# Altium schematic sheet Modulo-1B-TY.SchDoc
size B; Revision: PVT
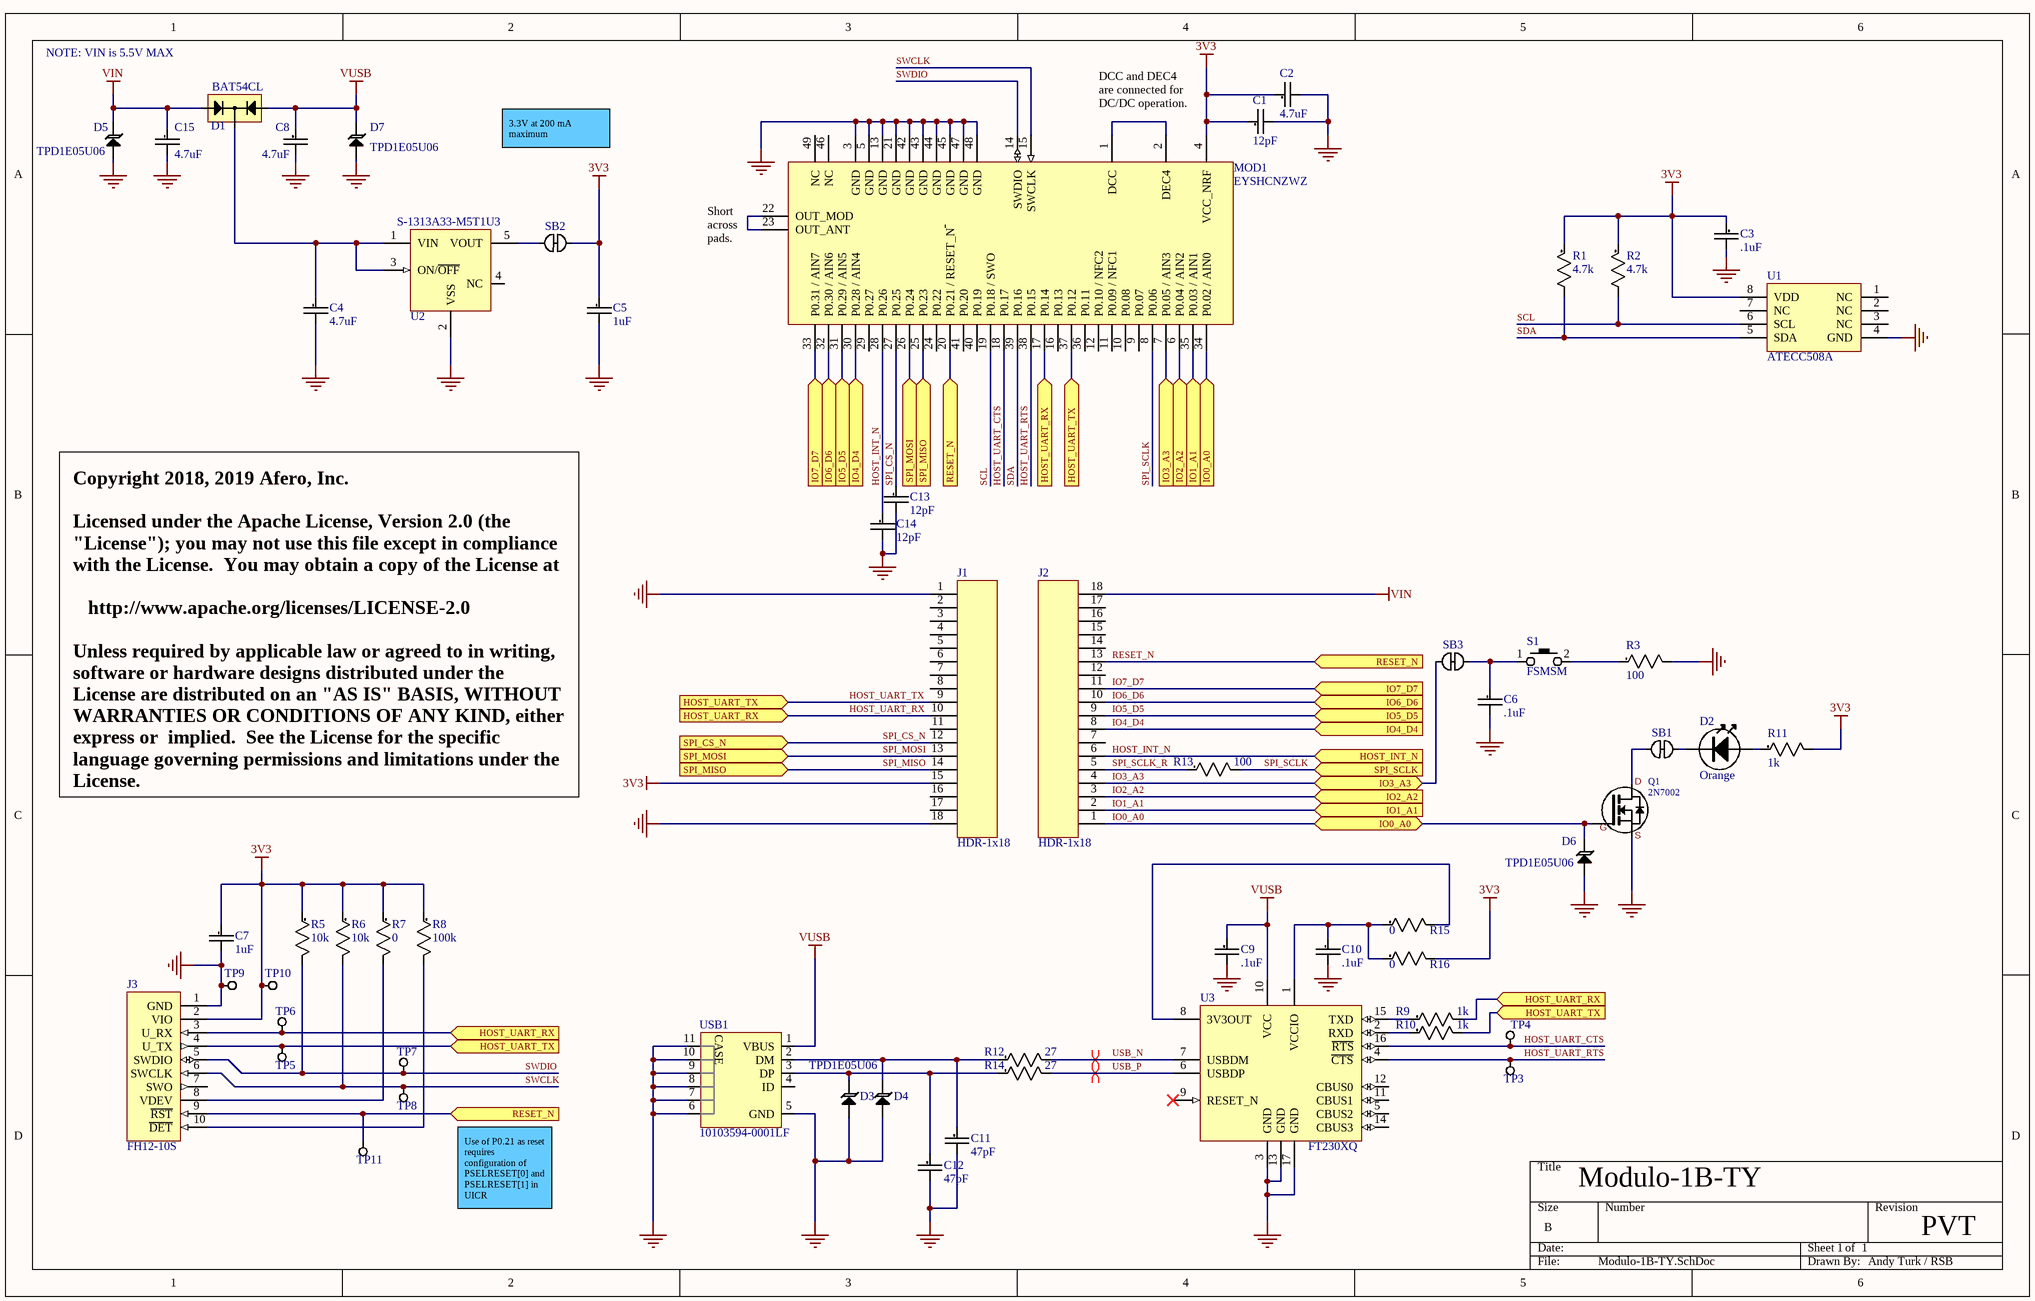
[diagram p0: Modulo-1B-TY.SchDoc]

## Parts
C1  12pF  [0402C-GENERIC]
C2  4.7uF  [0603C-GENERIC]
C3  .1uF  [0402C-GENERIC]
C4  4.7uF  [0603C-GENERIC]
C5  1uF  [0402C-GENERIC]
C6  .1uF  [0402C-GENERIC]
C7  1uF  [0402C-GENERIC]
C8  4.7uF  [0603C-GENERIC]
C9  .1uF  [0402C-GENERIC]
C10  .1uF  [0402C-GENERIC]
C11  47pF  [0402C-GENERIC]
C12  47pF  [0402C-GENERIC]
C13  12pF  [0402C-GENERIC]
C14  12pF  [0402C-GENERIC]
C15  4.7uF  [0603C-GENERIC]
D1  BAT54CL  [SOT23]
D2  Orange  [0603LED]
D3  TPD1E05U06  [SON70P100X45-2N]
D4  TPD1E05U06  [SON70P100X45-2N]  (value not drawn)
D5  TPD1E05U06  [SON70P100X45-2N]
D6  TPD1E05U06  [SON70P100X45-2N]
D7  TPD1E05U06  [SON70P100X45-2N]
J1  HDR-1x18  [HDR-1X18]
J2  HDR-1x18  [HDR-1X18]
J3  FH12-10S
MOD1  EYSHCNZWZ  [EYSHCNZWZ]
Q1  2N7002  [SOT23]
R1  4.7k  [0402R-GENERIC]
R2  4.7k  [0402R-GENERIC]
R3  100  [0402R-GENERIC]
R5  10k  [0402R-GENERIC]
R6  10k  [0402R-GENERIC]
R7  0  [0603R-generic]
R8  100k  [0402R-GENERIC]
R9  1k  [0402R-GENERIC]
R10  1k  [0402R-GENERIC]
R11  1k  [0402R-GENERIC]
R12  27  [0402R-GENERIC]
R13  100  [0402R-GENERIC]
R14  27  [0402R-GENERIC]
R15  0  [0402R-GENERIC]
R16  0  [0402R-GENERIC]
S1  FSMSM  [FSMSM]
SB1  Solderbridge  [SBNC]  (value not drawn)  (net tie, no BOM)
SB2  Solderbridge  [SBNC]  (value not drawn)  (net tie, no BOM)
SB3  Solderbridge  [SBNC]  (value not drawn)  (net tie, no BOM)
TP3  TP1MM  [TP1MM]  (value not drawn)  (no BOM)
TP4  TP1MM  [TP1MM]  (value not drawn)  (no BOM)
TP5  TP1MM  [TP1MM]  (value not drawn)  (no BOM)
TP6  TP1MM  [TP1MM]  (value not drawn)  (no BOM)
TP7  TP1MM  [TP1MM]  (value not drawn)  (no BOM)
TP8  TP1MM  [TP1MM]  (value not drawn)  (no BOM)
TP9  TP1MM  [TP1MM]  (value not drawn)  (no BOM)
TP10  TP1MM  [TP1MM]  (value not drawn)  (no BOM)
TP11  TP1MM  [TP1MM]  (value not drawn)  (no BOM)
U1  ATECC508A  [SON50P300X60-8N]
U2  S-1313A33-M5T1U3  [SOT95P275X130-5N]
U3  FT230XQ  [VQFN65P400X400X90-16N]
USB1  10103594-0001LF  [10103594-0001LF]

## Ports
HOST_INT_N, HOST_UART_RX, HOST_UART_TX, IO0_A0, IO1_A1, IO2_A2, IO3_A3, IO4_D4, IO5_D5, IO6_D6, IO7_D7, RESET_N, SPI_CS_N, SPI_MISO, SPI_MOSI, SPI_SCLK (in)

## Nets
3V3: C1.1 C2.1 C3.1 C5.1 C7.1 J1.15 J3.2(VIO) MOD1.4(VCC_NRF) R1.1 R2.1 R5.1 R6.1 R7.1 R8.1 R11.2 R16.2 SB2.2 TP10.1 U1.8(VDD)
GND: C1.2 C2.2 C3.2 C4.2 C5.2 C6.2 C7.2 C8.2 C9.2 C10.2 C11.2 C12.2 C13.2 C14.2 C15.2 D3.2(GND) D4.2(GND) D5.2(GND) D6.2(GND) D7.2(GND) J1.1 J1.18 J3.1(GND) MOD1.3(GND) MOD1.5(GND) MOD1.13(GND) MOD1.21(GND) MOD1.42(GND) MOD1.43(GND) MOD1.44(GND) MOD1.45(GND) MOD1.47(GND) MOD1.48(GND) Q1.2(S) R3.2 TP9.1 U1.4(GND) U2.2(VSS) U3.3(GND) U3.13(GND) U3.17(GND) USB1.5(GND) USB1.6(CASE) USB1.7(CASE) USB1.8(CASE) USB1.9(CASE) USB1.10(CASE) USB1.11(CASE)
VIN: C15.1 D1.1 D5.1(I/O) J2.18
VUSB: C8.1 C9.1 D1.2 D7.1(I/O) U3.10(VCC) USB1.1(VBUS)
HOST_INT_N: C14.1 J2.6 MOD1.28(P0.26) ; port HOST_INT_N
HOST_UART_CTS: MOD1.18(P0.17) TP4.1 U3.16(~{RTS})
HOST_UART_RTS: MOD1.38(P0.15) TP3.1 U3.4(~{CTS})
HOST_UART_RX: J1.10 J3.3(U_RX) MOD1.17(P0.14) R9.2 TP6.1 ; port HOST_UART_RX
HOST_UART_TX: J1.9 J3.4(U_TX) MOD1.37(P0.12) R10.2 TP5.1 ; port HOST_UART_TX
IO0_A0: D6.1(I/O) J2.1 MOD1.34(P0.02_/_AIN0) Q1.1(G) ; port IO0_A0
IO1_A1: J2.2 MOD1.35(P0.03_/_AIN1) ; port IO1_A1
IO2_A2: J2.3 MOD1.6(P0.04_/_AIN2) ; port IO2_A2
IO3_A3: J2.4 MOD1.7(P0.05_/_AIN3) SB3.1 ; port IO3_A3
IO4_D4: J2.8 MOD1.30(P0.28_/_AIN4) ; port IO4_D4
IO5_D5: J2.9 MOD1.31(P0.29_/_AIN5) ; port IO5_D5
IO6_D6: J2.10 MOD1.32(P0.30_/_AIN6) ; port IO6_D6
IO7_D7: J2.11 MOD1.33(P0.31_/_AIN7) ; port IO7_D7
RESET_N: J2.13 J3.9(~{RST}) MOD1.20(P0.21_/_RESET_N~{_}) TP11.1 ; port RESET_N
SCL: MOD1.19(P0.18_/_SWO) R2.2 U1.6(SCL)
SDA: MOD1.39(P0.16) R1.2 U1.5(SDA)
SPI_CS_N: C13.1 J1.12 MOD1.27(P0.25) ; port SPI_CS_N
SPI_MISO: J1.14 MOD1.25(P0.23) ; port SPI_MISO
SPI_MOSI: J1.13 MOD1.26(P0.24) ; port SPI_MOSI
SPI_SCLK: MOD1.8(P0.06) R13.2 ; port SPI_SCLK
SPI_SCLK_R: J2.5 R13.1
SWCLK: J3.6(SWCLK) MOD1.15(SWCLK) R6.2 TP8.1
SWDIO: J3.5(SWDIO) MOD1.14(SWDIO) R5.2 TP7.1
USB_N: R12.2 U3.7(USBDM)
USB_P: R14.2 U3.6(USBDP)
NetC4_1: C4.1 D1.3 U2.1(VIN) U2.3(ON/~{OFF})
NetC6_1: C6.1 S1.1 SB3.2
NetC10_1: C10.1 R15.1 R16.1 U3.1(VCCIO)
NetC11_1: C11.1 D4.1(I/O) R12.1 USB1.2(DM)
NetC12_1: C12.1 D3.1(I/O) R14.1 USB1.3(DP)
NetD2_A: D2.A R11.1
NetD2_K: D2.K SB1.2
NetJ3_8: J3.8(VDEV) R7.2
NetJ3_10: J3.10(~{DET}) R8.2
NetMOD1_1: MOD1.1(DCC) MOD1.2(DEC4)
NetMOD1_22: MOD1.22(OUT_MOD) MOD1.23(OUT_ANT)
NetQ1_3: Q1.3(D) SB1.1
NetR3_1: R3.1 S1.2
NetR9_1: R9.1 U3.15(TXD)
NetR10_1: R10.1 U3.2(RXD)
NetR15_2: R15.2 U3.8(3V3OUT)
NetSB2_1: SB2.1 U2.5(VOUT)

Not connected (* = marked no-connect by the designer): J1 2 3 4 5 6 7 8 11 16 17; J2 7 12 14 15 16 17; J3 7(SWO); MOD1 9(P0.07) 10(P0.08) 11(P0.09_/_NFC1) 12(P0.10_/_NFC2) 16(P0.13) 24(P0.22) 29(P0.27) 36(P0.11) 40(P0.19) 41(P0.20) 46(NC) 49(NC); U1 1(NC) 2(NC) 3(NC) 7(NC); U2 4(NC); U3 5(CBUS2) 9(RESET_N)* 11(CBUS1) 12(CBUS0) 14(CBUS3); USB1 4(ID)

## Layout directives
differential pair: USB_N, USB_P

## Notes on the sheet
- NOTE: VIN is 5.5V MAX
- 3.3V at 200 mA maximum
- (near MOD1) DCC and DEC4 are connected for DC/DC operation.
- (near MOD1) Short across pads.
- Copyright 2018, 2019 Afero, Inc.
  Licensed under the Apache License, Version 2.0 (the "License"); you may not use this file except in compliance with the License.  You may obtain a copy of the License at
  http://www.apache.org/licenses/LICENSE-2.0
  Unless required by applicable law or agreed to in writing, software or hardware designs distributed under the License are distributed on an "AS IS" BASIS, WITHOUT WARRANTIES OR CONDITIONS OF ANY KIND, either express or  implied.  See the License for the specific language governing permissions and limitations under the License.
- Modulo-1B-TY
- Use of P0.21 as reset requires configuration of PSELRESET[0] and PSELRESET[1] in UICR
- 1
- Andy Turk / RSB

## Library data of the parts
C1 C13 C14 = 0402C-12p: Capacitor, C0G; Manufacturer: Murata; Manufacturer Part Number: GJM1555C1H120FB01D; Tolerance: 1%; Voltage Rating: 50V; item_number: E-CAP-00106-00; Supplier 1: Digi-Key; Supplier Part Number 1: 490-11190-1-ND; Mount: Surface Mount; Case/Package: 0402; Case Code (Metric): 1005; Case Code (Imperial): 0402; Min Operating Temperature: -55°C; Max Operating Temperature: 125°C; Capacitance: 12pF; Voltage Rating (DC): 50V; Packaging: Tape and Reel; Package Quantity: 10000; Dielectric: C0G; Termination: SMD/SMT; Length: 1mm; Height: 0.5mm; Width: 0.02inch; Thickness: 0.022inch; Depth: 0.5mm; Radiation Hardening: No; REACH SVHC: No SVHC; Lead Free: Lead Free
C2 C4 C8 C15 = 0603C-4u7: Capacitor; Manufacturer: Murata; Manufacturer Part Number: GRM188R61C475KAAJD; Value: 4u7; Material: Ceramic; Tolerance: 10%; Dielectric: X5R; Voltage Rating: 16V; item_number: E-CAP-00066-00; Supplier 1: Mouser; Stock 1: 241267; Pricing 1: 1=0.27, 10=0.184, 50=0.184, 100=0.105, 1000=0.065, 10000=0.054 (USD); Mount: Surface Mount; Case/Package: 0603; Weight: 0.000222oz; Case Code (Metric): 1608; Case Code (Imperial): 0603; Min Operating Temperature: -55°C; Max Operating Temperature: 85°C; Capacitance: 4.7uF; Packaging: Tape and Reel; Termination: SMD/SMT; Voltage Rating (DC): 16V; Package Quantity: 4000; Length: 1.6mm; Height: 0.8mm; Width: 0.8mm; Thickness: 0.037inch; Depth: 0.8mm; REACH SVHC: No SVHC; Lead Free: Lead Free; ComponentLink1URL: https://datasheet.ciiva.com/14813/595grm188r61c475kaaj23-14813668.pdf; ComponentLink1Description: https://datasheet.ciiva.com/14813/595grm188r61c475kaaj23-14813668.pdf; Supplier Part Number 1: 81-GRM188R61C475KAJD
C3 C6 C9 C10 = 0402C-100n: Capacitor, MLCC; Manufacturer: Murata; Manufacturer Part Number: GRM155R61H104KE19D; Tolerance: 10%; Voltage Rating: 50V; Dielectric: X5R; item_number: E-CAP-00004-00; Supplier 1: Mouser; Stock 1: 727844; Pricing 1: 1=0.1, 10=0.068, 50=0.068, 100=0.03, 1000=0.017, 10000=0.011 (USD); Mount: Surface Mount; Case/Package: 0402; Case Code (Metric): 1005; Case Code (Imperial): 0402; Min Operating Temperature: -55°C; Max Operating Temperature: 85°C; Packaging: Tape and Reel; Capacitance: .1uF; Voltage: 50V; Voltage Rating (DC): 50V; Length: 1mm; Height: 0.5mm; Width: 0.02inch; Thickness: 0.022inch; Depth: 0.5mm; REACH SVHC: No SVHC; Lead Free: Lead Free; ComponentLink1URL: https://datasheet.ciiva.com/22698/1666664-22698413.pdf; ComponentLink1Description: https://datasheet.ciiva.com/22698/1666664-22698413.pdf; ComponentLink2URL: https://datasheet.ciiva.com/7719/1666664-7719007.pdf; ComponentLink2Description: https://datasheet.ciiva.com/7719/1666664-7719007.pdf; Supplier Part Number 1: 81-GRM155R61H104KE9D
C5 C7 = 0402C-1u: Capacitor, MLCC; Manufacturer: Murata Electronics; Manufacturer Part Number: GRM155R60J105ME19J; Tolerance: 20 %; Type: Chip Monolithic Ceramic Capacitor; Voltage Rating DC: 6.3 VDC; Capacitance - nF: 1000 nF; Dielectric: X5R; Value: 1u; item_number: E-CAP-00020-00; Supplier 1: Mouser; RoHS: RoHS Compliant; Category: Multilayer Ceramic Capacitors MLCC - SMD/SMT; Stock 1: 17644; Pricing 1: 1=0.100, 10=0.080, 100=0.040, 500=0.030, 1000=0.020, 50000=0.020 (USD); Capacitance: 1uF; Height: 0.5 mm; Length: 1 mm; Package / Case: 0402 (1005 metric); Packaging: Cut Tape; Product: General Type MLCCs; Series: GRM; Termination Style: SMD/SMT; Width: 0.5 mm; Brand: Murata Electronics; Case Code - in: 0402; Case Code - mm: 1005; Maximum Operating Temperature: + 85 C; Minimum Operating Temperature: - 55 C; Standard Pack Qty: 50000; RoHS - Mouser: Y; Minimum Order Quantity: 1; Reeling: True; ComponentLink1URL: http://www.mouser.com/ds/2/281/c02e-2905.pdf; ComponentLink1Description: http://www.mouser.com/ds/2/281/c02e-2905.pdf; Supplier Part Number 1: 81-GRM155R60J105ME9J
C11 C12 = 0402C-47p: Capacitor, C0G; Manufacturer: Murata; Manufacturer Part Number: GRM1555C1H470JZ01D; Dielectric Material: Ceramic; Tolerance: 5%; Voltage Rating: 50V; Temperature Coefficient: 30ppm/°C; Insulation Resistance: 10GR; item_number: E-CAP-00019-00; Supplier 1: Digi-Key; Supplier Part Number 1: 490-1287-2-ND; Stock 1: 0; Mount: Surface Mount; Case/Package: 0402; Number of Pins: 2; Case Code (Metric): 1005; Case Code (Imperial): 0402; Min Operating Temperature: -55°C; Max Operating Temperature: 125°C; Packaging: Tape and Reel; Capacitance: 47pF; Dielectric: C0G; Voltage Rating (DC): 50V; Package Quantity: 1; Termination: SMD/SMT; Voltage: 50V; Length: 1mm; Height: 0.5mm; Width: 0.5mm; Depth: 0.5mm; Thickness: 0.022inch; Radiation Hardening: No; REACH SVHC: No SVHC; Lead Free: Lead Free; ComponentLink1URL: https://datasheet.ciiva.com/129/product-129747.pdf; ComponentLink1Description: https://datasheet.ciiva.com/129/product-129747.pdf; ComponentLink2URL: https://datasheet.ciiva.com/11787/0900766b807a1cab-11787251.pdf; ComponentLink2Description: https://datasheet.ciiva.com/11787/0900766b807a1cab-11787251.pdf; ComponentLink3URL: https://datasheet.ciiva.com/129/partnumbering-e-01-129748.pdf; ComponentLink3Description: https://datasheet.ciiva.com/129/partnumbering-e-01-129748.pdf; ComponentLink4URL: https://datasheet.ciiva.com/129/partnumbering-e-01-129749.pdf; ComponentLink4Description: https://datasheet.ciiva.com/129/partnumbering-e-01-129749.pdf; ComponentLink5URL: https://datasheet.ciiva.com/16396/l0005e-16396809.pdf; ComponentLink5Description: https://datasheet.ciiva.com/16396/l0005e-16396809.pdf; ComponentLink6URL: https://datasheet.ciiva.com/18100/getdatasheetpartid-32342-18100875.pdf; ComponentLink6Description: https://datasheet.ciiva.com/18100/getdatasheetpartid-32342-18100875.pdf
D1 = BAT54CL: Dual Common Cathode  Schottky  Diodes; Manufacturer: ON Semiconductor; Manufacturer Part Number: BAT54CLT1G; Forward Current: 200mA; Recovery Time: 5ns; Max Reverse Leakage Current: 2uA; Max Forward Surge Current (Ifsm): 600mA; Max Reverse Voltage (DC): 30V; Max Power Dissipation: 225mW; Capacitance: 10pF; Forward Voltage: 800mV; item_number: E-DIO-00010-00; Supplier 1: Digi-Key; Supplier Part Number 1: BAT54CLT1GOSCT-ND; Stock 1: 151531; Pricing 1: 1=0.15, 10=0.133, 100=0.0727, 500=0.0447, 1000=0.0305 (USD); Case/Package: SOT-23-3; Number of Pins: 3; Contact Plating: Tin,Matte; Min Operating Temperature: -55°C; Max Operating Temperature: 125°C; Element Configuration: Common Cathode; Packaging: Tape and Reel; Package Quantity: 3000; Average Rectified Current: 200mA; Reverse Recovery Time: 5ns; Max Surge Current: 600mA; Peak Non-Repetitive Surge Current: 600mA; Max Repetitive Reverse Voltage (Vrrm): 30V; Current Rating: 200mA; Voltage Rating (DC): 30V; Peak Reverse Current: 2uA; Power Dissipation: 225mW; Length: 3.04mm; Height: 1.01mm; Width: 1.4mm; Radiation Hardening: No; Lead Free: Lead Free; Halogen Free: Halogen Free; REACH SVHC: No SVHC; ComponentLink1URL: https://datasheet.ciiva.com/1240/bat54clt1-d-1240707.pdf; ComponentLink1Description: https://datasheet.ciiva.com/1240/bat54clt1-d-1240707.pdf; ComponentLink2URL: https://datasheet.ciiva.com/22659/1918740-22659014.pdf; ComponentLink2Description: https://datasheet.ciiva.com/22659/1918740-22659014.pdf; ComponentLink3URL: https://datasheet.ciiva.com/34301/885769-34301654.pdf; ComponentLink3Description: https://datasheet.ciiva.com/34301/885769-34301654.pdf; ComponentLink4URL: https://datasheet.ciiva.com/1180/bat54clt1-d-1180247.pdf; ComponentLink4Description: https://datasheet.ciiva.com/1180/bat54clt1-d-1180247.pdf; ComponentLink5URL: https://datasheet.ciiva.com/1180/bat54clt1-d-1180248.pdf; ComponentLink5Description: https://datasheet.ciiva.com/1180/bat54clt1-d-1180248.pdf; ComponentLink6URL: https://datasheet.ciiva.com/30479/0900766b8121b932-30479128.pdf; ComponentLink6Description: https://datasheet.ciiva.com/30479/0900766b8121b932-30479128.pdf; ComponentLink7URL: https://datasheet.ciiva.com/15144/getdatasheetpartid-98336-15144809.pdf; ComponentLink7Description: https://datasheet.ciiva.com/15144/getdatasheetpartid-98336-15144809.pdf; ComponentLink8URL: https://datasheet.ciiva.com/16205/bat54clt1-d-16205033.pdf; ComponentLink8Description: https://datasheet.ciiva.com/16205/bat54clt1-d-16205033.pdf; ComponentLink9URL: https://datasheet.ciiva.com/905/bat54clt1-d-905835.pdf; ComponentLink9Description: https://datasheet.ciiva.com/905/bat54clt1-d-905835.pdf; ComponentLink10URL: https://datasheet.ciiva.com/28655/bat54clt1-d-28655787.pdf; ComponentLink10Description: https://datasheet.ciiva.com/28655/bat54clt1-d-28655787.pdf; ComponentLink11URL: https://datasheet.ciiva.com/8299/bat54clt1-d-8299644.pdf; ComponentLink11Description: https://datasheet.ciiva.com/8299/bat54clt1-d-8299644.pdf; ComponentLink12URL: https://datasheet.ciiva.com/8294/bat54clt1-d-8294495.pdf; ComponentLink12Description: https://datasheet.ciiva.com/8294/bat54clt1-d-8294495.pdf
D2 = LED_0603: Manufacturer: Vishay Lite-On; Manufacturer Part Number: LTST-C190KAKT; Colour: Red,Orange; Lens Colour: Colorless; Forward Voltage: 2V; Test Current: 20mA; Forward Current: 30mA; Wavelength: 621nm; Luminous Intensity: 54mcd; Lens Style: Flat,Diffused,Colorless,Rectangular; Viewing Angle: 130°; Dominant Wavelength: 615nm; Lens Transparency: Clear; Number of Elements: 1; Power Dissipation: 75mW; Reverse Voltage: 5V; item_number: E-LED-00009-00; Supplier 1: Digi-Key; Supplier Part Number 1: 160-1433-1-ND; Stock 1: 60967; Pricing 1: 1=0.41, 10=0.296, 25=0.2268, 100=0.148, 250=0.1085, 500=0.0921, 1000=0.0757 (USD); Mount: Surface Mount; Case/Package: 0603; Number of Pins: 2; Case Code (Metric): 1608; Case Code (Imperial): 0603; Min Operating Temperature: -55°C; Max Operating Temperature: 85°C; Packaging: Tape and Reel; Package Quantity: 1; Illumination Colour: Orange; Number of LEDs: 1; Orientation: Top View; Length: 1.6mm; Height: 0.8mm; Width: 0.8mm; Depth: 1.6mm; Radiation Hardening: No; Lead Free: Lead Free; ComponentLink1URL: https://datasheet.ciiva.com/24120/ltst-c190kakt-267511-24120611.pdf; ComponentLink1Description: https://datasheet.ciiva.com/24120/ltst-c190kakt-267511-24120611.pdf; ComponentLink2URL: https://datasheet.ciiva.com/26937/getdatasheetpartid-257177-26937956.pdf; ComponentLink2Description: https://datasheet.ciiva.com/26937/getdatasheetpartid-257177-26937956.pdf; ComponentLink3URL: https://datasheet.ciiva.com/2110/ltst-c150-170-190kxkt-2110261.pdf; ComponentLink3Description: https://datasheet.ciiva.com/2110/ltst-c150-170-190kxkt-2110261.pdf; ComponentLink4URL: https://datasheet.ciiva.com/2110/ltst-c150-170-190kxkt-2110262.pdf; ComponentLink4Description: https://datasheet.ciiva.com/2110/ltst-c150-170-190kxkt-2110262.pdf; ComponentLink5URL: https://datasheet.ciiva.com/2110/ltst-c150-170-190kxkt-2110263.pdf; ComponentLink5Description: https://datasheet.ciiva.com/2110/ltst-c150-170-190kxkt-2110263.pdf
D3-D7 = TPD1E05U06: TVS Diode; Manufacturer: Texas Instruments; Manufacturer Part Number: TPD1E05U06DPYR; Number of Channels: 1; Interface: LVDS,USB,Ethernet,HDMI,PCIe,SATA; Operating Supply Voltage: 5.5V; Capacitance: 0.5pF; Direction: Unidirectional; Min Breakdown Voltage: 6V; Clamping Voltage: 14V; Peak Pulse Power: 40W; Power Line Protection: Yes; Breakdown Voltage: 6.5V; Polarity: Bidirectional; Leakage Current: 10nA; Element Configuration: Single; Peak Pulse Current: 2.5A; item_number: E-DIO-00008-00; Supplier 1: Digi-Key; Supplier Part Number 1: 296-39341-1-ND; Stock 1: 161045; Pricing 1: 1=0.5, 10=0.372, 100=0.2107, 500=0.1395, 1000=0.107 (USD); Mount: Surface Mount; Number of Pins: 2; Min Operating Temperature: -40°C; Max Operating Temperature: 125°C; Package Quantity: 10000; Packaging: Tape and Reel; Number of Bidirectional Channels: 1; Reverse Standoff Voltage: 5.5V; Termination: SMD/SMT; Working Voltage: 5.5V; Max Power Dissipation: 40W; Length: 1.1mm; Radiation Hardening: No; Lead Free: Lead Free; REACH SVHC: No SVHC; ComponentLink1URL: https://datasheet.ciiva.com/12545/tpd1e05u06-224685-12545140.pdf; ComponentLink1Description: https://datasheet.ciiva.com/12545/tpd1e05u06-224685-12545140.pdf; ComponentLink2URL: https://datasheet.ciiva.com/26918/getdatasheetpartid-700473-26918022.pdf; ComponentLink2Description: https://datasheet.ciiva.com/26918/getdatasheetpartid-700473-26918022.pdf; ComponentLink3URL: https://datasheet.ciiva.com/6574/tpd1e05u06-6574667.pdf; ComponentLink3Description: https://datasheet.ciiva.com/6574/tpd1e05u06-6574667.pdf
J1 J2 = HDR-1x18: item_number: M-CON-00058-00
J3 = SAD-WIFI: Afero SAD connector; Manufacturer: Hirose; Manufacturer Part Number: FH12-10S-0.5SH(55); Actuator Material: Polyphenylene; Contact Location: Bottom; Contact Resistance: 50mR; Current Rating: 500mA; Gender: Female; Insulation Resistance: 500MR; item_number: M-CON-00064-00; Mating Cycles: 20; Max Current Rating: 400mA; Max Voltage Rating (AC): 50V; Number of Contacts: 10; Pitch: 0.5mm; Wire/Cable Type: Straight; Colour: Beige,Brown; ComponentLink1Description: https://datasheet.ciiva.com/15176/getdatasheetpartid-470028-15176901.pdf; ComponentLink1URL: https://datasheet.ciiva.com/15176/getdatasheetpartid-470028-15176901.pdf; ComponentLink2Description: https://datasheet.ciiva.com/7661/58803-7661366.pdf; ComponentLink2URL: https://datasheet.ciiva.com/7661/58803-7661366.pdf; ComponentLink3Description: https://datasheet.ciiva.com/11745/0900766b80d985fc-11745079.pdf; ComponentLink3URL: https://datasheet.ciiva.com/11745/0900766b80d985fc-11745079.pdf; ComponentLink4Description: https://datasheet.ciiva.com/22630/58803-22630330.pdf; ComponentLink4URL: https://datasheet.ciiva.com/22630/58803-22630330.pdf; Contact Material: Bronze; Contact Plating: Gold; Depth: 5.6mm; Flammability Rating: UL94 V-0; Housing Colour: Beige; Housing Material: Polyamide; Lead Free: Lead Free; Lead Pitch: 0.5mm; Length: 9.1mm; Material: Polyamide; Max Operating Temperature: 70°C; Min Operating Temperature: -40°C; Mount: Surface Mount; Number of Positions: 10; Number of Rows: 1; Orientation: Right Angle; Package Quantity: 2000; Packaging: Tape and Reel; Pricing 1: 1=1.54, 10=1.401, 25=1.3156, 50=1.2584, 100=1.2012, 250=1.0868, 500=1.001, 1000=0.858 (USD); Radiation Hardening: No; REACH SVHC: No SVHC; Stock 1: 35610; Supplier 1: Digi-Key; Supplier Part Number 1: HFJ110CT-ND; Termination: Solder; Voltage Rating (AC): 50V; Voltage Rating: 50V; Width: 9.1mm
MOD1 = EYSHCNZWZ: Bluetooth 5.0 Low Energy Module; Manufacturer: Taiyo Yuden; item_number: E-ICS-00091-00; Supplier 1: Mouser; Supplier Part Number 1: 963-EYSHCNZWZ; Stock 1: 753; Pricing 1: 1=9.67, 10=8.75, 50=7.59, 100=7.36, 1000=6.12, 10000=6.12 (USD); Manufacturer Part Number: EYSHCNZWZ
Q1 = Nch_MOSFET_2N7002: MOSFET N-CH 60V 115mA SOT23; Manufacturer: On Semiconductor; Commodity: FET; Mounting: *; Manufacturer Part Number: 2N7002; Replace: *; Value: 2N7002
R1 R2 = 0402R-4k7: Resistor 4k7; Manufacturer: Panasonic; Manufacturer Part Number: ERJ-2GEJ472X; Tolerance: 5%; Voltage Rating: 50V; Temperature Coefficient: 200ppm/°C; Power Rating: 100mW; item_number: E-RES-00039-00; Supplier 1: Digi-Key; Supplier Part Number 1: P4.7KJCT-ND; Stock 1: 10404054; Pricing 1: 1=0.1, 10=0.038, 100=0.0154, 1000=0.0069, 2500=0.006, 5000=0.005 (USD); Mount: Surface Mount; Case/Package: 0402; Case Code (Imperial): 0402; Case Code (Metric): 1005; Contact Plating: Tin; Min Operating Temperature: -55°C; Max Operating Temperature: 155°C; Resistance: 4.7k; Packaging: Cut Tape; Termination: SMD/SMT; Military Standard: Not; Package Quantity: 1; Composition: Thick Film; Number of Terminations: 2; Max Power Dissipation: 100mW; Voltage Rating (DC): 50V; Features: Automotive AEC-Q200; Length: 1mm; Height: 0.35mm; Width: 0.5mm; Depth: 0.5mm; Radiation Hardening: No; REACH SVHC: No SVHC; Lead Free: Lead Free; ComponentLink1URL: https://datasheet.ciiva.com/11821/0900766b80f806dd-11821328.pdf; ComponentLink1Description: https://datasheet.ciiva.com/11821/0900766b80f806dd-11821328.pdf; ComponentLink2URL: https://datasheet.ciiva.com/16758/70260739-16758341.pdf; ComponentLink2Description: https://datasheet.ciiva.com/16758/70260739-16758341.pdf; ComponentLink3URL: https://datasheet.ciiva.com/16770/70260739-16770309.pdf; ComponentLink3Description: https://datasheet.ciiva.com/16770/70260739-16770309.pdf; ComponentLink4URL: https://datasheet.ciiva.com/28514/1678796-28514168.pdf; ComponentLink4Description: https://datasheet.ciiva.com/28514/1678796-28514168.pdf; ComponentLink5URL: https://datasheet.ciiva.com/17213/aoa0000ce1-17213178.pdf; ComponentLink5Description: https://datasheet.ciiva.com/17213/aoa0000ce1-17213178.pdf; ComponentLink6URL: https://datasheet.ciiva.com/16523/aoa0000ce1-16523499.pdf; ComponentLink6Description: https://datasheet.ciiva.com/16523/aoa0000ce1-16523499.pdf; ComponentLink7URL: https://datasheet.ciiva.com/46377/1678796-46377565.pdf; ComponentLink7Description: https://datasheet.ciiva.com/46377/1678796-46377565.pdf
R3 R13 = 0402R-100R: Resistor 100R; Manufacturer: Vishay Dale; Manufacturer Part Number: CRCW0402100RFKED; Tolerance: 1%; Temperature Coefficient: 100ppm/°C; Voltage Rating (DC): 50V; Power Rating: 63mW; item_number: E-RES-00008-00; Supplier 1: Digi-Key; Supplier Part Number 1: 541-100LCT-ND; Stock 1: 0; Pricing 1: 1=0.1, 10=0.044, 100=0.0178, 1000=0.008, 2500=0.007, 5000=0.0058 (USD); Mount: Surface Mount; Case/Package: 0402; Weight: 2.3E-05oz; Case Code (Metric): 1005; Case Code (Imperial): 0402; Contact Plating: Tin; Min Operating Temperature: -55°C; Max Operating Temperature: 155°C; Resistance: 100; Packaging: Tape and Reel; Voltage Rating: 50V; Termination: SMD/SMT; Package Quantity: 10; Composition: Thick Film; Number of Terminations: 2; Military Standard: Not; Max Power Dissipation: 63mW; Features: Automotive AEC-Q200; Working Voltage: 50V; Length: 1mm; Height: 0.35mm; Width: 0.02inch; Depth: 0.5mm; Radiation Hardening: No; REACH SVHC: Unknown; Lead Free: Lead Free; ComponentLink1URL: https://datasheet.ciiva.com/2463/dcrcwe3-2463094.pdf; ComponentLink1Description: https://datasheet.ciiva.com/2463/dcrcwe3-2463094.pdf; ComponentLink2URL: https://datasheet.ciiva.com/16199/dcrcwe3-16199158.pdf; ComponentLink2Description: https://datasheet.ciiva.com/16199/dcrcwe3-16199158.pdf; ComponentLink3URL: https://datasheet.ciiva.com/2463/dcrcwe3-2463095.pdf; ComponentLink3Description: https://datasheet.ciiva.com/2463/dcrcwe3-2463095.pdf; ComponentLink4URL: https://datasheet.ciiva.com/2463/dcrcwe3-2463096.pdf; ComponentLink4Description: https://datasheet.ciiva.com/2463/dcrcwe3-2463096.pdf; ComponentLink5URL: https://datasheet.ciiva.com/5552/dcrcwe3-109170-5552168.pdf; ComponentLink5Description: https://datasheet.ciiva.com/5552/dcrcwe3-109170-5552168.pdf; ComponentLink6URL: https://datasheet.ciiva.com/8083/dcrcwe3-8083977.pdf; ComponentLink6Description: https://datasheet.ciiva.com/8083/dcrcwe3-8083977.pdf; ComponentLink7URL: https://datasheet.ciiva.com/11809/0900766b80d98824-11809081.pdf; ComponentLink7Description: https://datasheet.ciiva.com/11809/0900766b80d98824-11809081.pdf; ComponentLink8URL: https://datasheet.ciiva.com/16722/70201119-16722524.pdf; ComponentLink8Description: https://datasheet.ciiva.com/16722/70201119-16722524.pdf; ComponentLink9URL: https://datasheet.ciiva.com/22673/1697337-22673117.pdf; ComponentLink9Description: https://datasheet.ciiva.com/22673/1697337-22673117.pdf; ComponentLink10URL: https://datasheet.ciiva.com/22673/1697337-22673118.pdf; ComponentLink10Description: https://datasheet.ciiva.com/22673/1697337-22673118.pdf; ComponentLink11URL: https://datasheet.ciiva.com/3255/dcrcwe3-3255951.pdf; ComponentLink11Description: https://datasheet.ciiva.com/3255/dcrcwe3-3255951.pdf
R5 R6 = 0402R-10k: Resistor 10k; Manufacturer: Vishay Dale; Manufacturer Part Number: CRCW040210K0JNED; Tolerance: 5%; Power Rating: 63mW; Voltage Rating: 50V; Temperature Coefficient: 200ppm/°C; item_number: E-RES-00001-00; Supplier 1: Digi-Key; Supplier Part Number 1: 541-10KJCT-ND; Stock 1: 0; Pricing 1: 1=0.1, 10=0.031, 100=0.0125, 1000=0.0056, 2500=0.0049, 5000=0.004 (USD); Mount: Surface Mount; Case/Package: 0402; Weight: 2.3E-05oz; Case Code (Imperial): 0402; Case Code (Metric): 1005; Contact Plating: Tin; Min Operating Temperature: -55°C; Max Operating Temperature: 155°C; Resistance: 10k; Packaging: Tape and Reel; Termination: SMD/SMT; Package Quantity: 1; Composition: Thick Film; Military Standard: Not; Number of Terminations: 2; Max Power Dissipation: 63mW; Features: Automotive AEC-Q200; Length: 1mm; Height: 0.016inch; Depth: 0.5mm; Width: 0.5mm; Radiation Hardening: No; REACH SVHC: Unknown; ComponentLink1URL: https://datasheet.ciiva.com/2461/dcrcwe3-2461974.pdf; ComponentLink1Description: https://datasheet.ciiva.com/2461/dcrcwe3-2461974.pdf; ComponentLink2URL: https://datasheet.ciiva.com/2461/dcrcwe3-2461975.pdf; ComponentLink2Description: https://datasheet.ciiva.com/2461/dcrcwe3-2461975.pdf; ComponentLink3URL: https://datasheet.ciiva.com/2461/dcrcwe3-2461976.pdf; ComponentLink3Description: https://datasheet.ciiva.com/2461/dcrcwe3-2461976.pdf; ComponentLink4URL: https://datasheet.ciiva.com/7743/dcrcwe3-7743416.pdf; ComponentLink4Description: https://datasheet.ciiva.com/7743/dcrcwe3-7743416.pdf; ComponentLink5URL: https://datasheet.ciiva.com/16771/70201119-16771096.pdf; ComponentLink5Description: https://datasheet.ciiva.com/16771/70201119-16771096.pdf; ComponentLink6URL: https://datasheet.ciiva.com/7743/dcrcwe3-7743417.pdf; ComponentLink6Description: https://datasheet.ciiva.com/7743/dcrcwe3-7743417.pdf; ComponentLink7URL: https://datasheet.ciiva.com/16761/70201119-16761947.pdf; ComponentLink7Description: https://datasheet.ciiva.com/16761/70201119-16761947.pdf; ComponentLink8URL: https://datasheet.ciiva.com/3255/dcrcwe3-3255964.pdf; ComponentLink8Description: https://datasheet.ciiva.com/3255/dcrcwe3-3255964.pdf; ComponentLink9URL: https://datasheet.ciiva.com/3255/dcrcwe3-3255965.pdf; ComponentLink9Description: https://datasheet.ciiva.com/3255/dcrcwe3-3255965.pdf
R7 = 0603R-0R0: Resistor 0R; Manufacturer: Panasonic; Manufacturer Part Number: ERJ-3GEY0R00V; Power Rating: 100mW; Voltage Rating: 75V; Voltage Rating (DC): 50V; Temperature Coefficient: 600ppm/°C; Tolerance: 0%; item_number: E-RES-00019-00; Supplier 1: Digi-Key; Supplier Part Number 1: P0.0GCT-ND; Stock 1: 17519314; Pricing 1: 1=0.1, 10=0.053, 25=0.038, 50=0.029, 100=0.0214, 250=0.0163, 500=0.0131, 1000=0.0096 (USD); Mount: Surface Mount; Case/Package: 0603; Case Code (Metric): 1608; Case Code (Imperial): 0603; Contact Plating: Tin; Min Operating Temperature: -55°C; Max Operating Temperature: 155°C; Packaging: Tape and Reel; Resistance: 0; Composition: Thick Film; Package Quantity: 1; Termination: SMD/SMT; Number of Terminations: 2; Military Standard: Not; Max Power Dissipation: 100mW; Features: Automotive AEC-Q200; Length: 1.6mm; Height: 0.45mm; Width: 0.031inch; Depth: 0.8mm; Radiation Hardening: No; REACH SVHC: No SVHC; Lead Free: Lead Free; ComponentLink1URL: https://datasheet.ciiva.com/48532/aoa0000ce1-48532165.pdf; ComponentLink1Description: https://datasheet.ciiva.com/48532/aoa0000ce1-48532165.pdf; ComponentLink2URL: https://datasheet.ciiva.com/43460/1678796-43460647.pdf; ComponentLink2Description: https://datasheet.ciiva.com/43460/1678796-43460647.pdf; ComponentLink3URL: https://datasheet.ciiva.com/27055/1935748-27055113.pdf; ComponentLink3Description: https://datasheet.ciiva.com/27055/1935748-27055113.pdf; ComponentLink4URL: https://datasheet.ciiva.com/28695/1678796-28695833.pdf; ComponentLink4Description: https://datasheet.ciiva.com/28695/1678796-28695833.pdf; ComponentLink5URL: https://datasheet.ciiva.com/5959/1678796-5959707.pdf; ComponentLink5Description: https://datasheet.ciiva.com/5959/1678796-5959707.pdf; ComponentLink6URL: https://datasheet.ciiva.com/16834/aoa0000ce1-16834828.pdf; ComponentLink6Description: https://datasheet.ciiva.com/16834/aoa0000ce1-16834828.pdf; ComponentLink7URL: https://datasheet.ciiva.com/17215/aoa0000ce1-17215388.pdf; ComponentLink7Description: https://datasheet.ciiva.com/17215/aoa0000ce1-17215388.pdf; ComponentLink8URL: https://datasheet.ciiva.com/46377/1678796-46377868.pdf; ComponentLink8Description: https://datasheet.ciiva.com/46377/1678796-46377868.pdf; ComponentLink9URL: https://datasheet.ciiva.com/30199/4aoa0000ce1-30199822.pdf; ComponentLink9Description: https://datasheet.ciiva.com/30199/4aoa0000ce1-30199822.pdf; ComponentLink10URL: https://datasheet.ciiva.com/9198/aoa0000ce1-9198975.pdf; ComponentLink10Description: https://datasheet.ciiva.com/9198/aoa0000ce1-9198975.pdf; ComponentLink11URL: https://datasheet.ciiva.com/11808/0900766b80f806dd-11808207.pdf; ComponentLink11Description: https://datasheet.ciiva.com/11808/0900766b80f806dd-11808207.pdf; ComponentLink12URL: https://datasheet.ciiva.com/16758/70255313-16758527.pdf; ComponentLink12Description: https://datasheet.ciiva.com/16758/70255313-16758527.pdf
R8 = 0402R-100k: Resistor 100k; Manufacturer: Panasonic; Manufacturer Part Number: ERJ-2GEJ104X; Power Rating: 100mW; Tolerance: 5%; Voltage Rating: 50V; Temperature Coefficient: 200ppm/°C; item_number: E-RES-00012-00; Supplier 1: Digi-Key; Supplier Part Number 1: P100KJCT-ND; Stock 1: 10583442; Pricing 1: 1=0.1, 10=0.038, 100=0.0154, 1000=0.0069, 2500=0.006, 5000=0.005 (USD); Mount: Surface Mount; Case/Package: 0402; Case Code (Metric): 1005; Case Code (Imperial): 0402; Contact Plating: Tin; Min Operating Temperature: -55°C; Max Operating Temperature: 155°C; Resistance: 100k; Packaging: Tape and Reel; Termination: SMD/SMT; Package Quantity: 1; Composition: Thick Film; Max Power Dissipation: 100mW; Number of Terminations: 2; Military Standard: Not; Voltage Rating (DC): 50V; Features: Automotive AEC-Q200; Length: 1mm; Height: 0.35mm; Depth: 0.5mm; Width: 0.02inch; Radiation Hardening: No; REACH SVHC: No SVHC; Lead Free: Lead Free; ComponentLink1URL: https://datasheet.ciiva.com/11821/0900766b80f806dd-11821174.pdf; ComponentLink1Description: https://datasheet.ciiva.com/11821/0900766b80f806dd-11821174.pdf; ComponentLink2URL: https://datasheet.ciiva.com/22758/1500035-22758198.pdf; ComponentLink2Description: https://datasheet.ciiva.com/22758/1500035-22758198.pdf; ComponentLink3URL: https://datasheet.ciiva.com/34303/1986799-34303543.pdf; ComponentLink3Description: https://datasheet.ciiva.com/34303/1986799-34303543.pdf; ComponentLink4URL: https://datasheet.ciiva.com/24023/aoa0000ce1-37422-24023480.pdf; ComponentLink4Description: https://datasheet.ciiva.com/24023/aoa0000ce1-37422-24023480.pdf; ComponentLink5URL: https://datasheet.ciiva.com/16777/70260739-16777321.pdf; ComponentLink5Description: https://datasheet.ciiva.com/16777/70260739-16777321.pdf; ComponentLink6URL: https://datasheet.ciiva.com/16759/70260739-16759692.pdf; ComponentLink6Description: https://datasheet.ciiva.com/16759/70260739-16759692.pdf; ComponentLink7URL: https://datasheet.ciiva.com/48531/aoa0000ce1-48531084.pdf; ComponentLink7Description: https://datasheet.ciiva.com/48531/aoa0000ce1-48531084.pdf; ComponentLink8URL: https://datasheet.ciiva.com/9186/aoa0000ce1-9186685.pdf; ComponentLink8Description: https://datasheet.ciiva.com/9186/aoa0000ce1-9186685.pdf; ComponentLink9URL: https://datasheet.ciiva.com/30204/4aoa0000ce1-30204557.pdf; ComponentLink9Description: https://datasheet.ciiva.com/30204/4aoa0000ce1-30204557.pdf; ComponentLink10URL: https://datasheet.ciiva.com/46389/1500035-46389645.pdf; ComponentLink10Description: https://datasheet.ciiva.com/46389/1500035-46389645.pdf
R9 R10 = 0402R-1k: Resistor 1k; Manufacturer: Yageo; Manufacturer Part Number: RT0402-FRE071KL; Tolerance: 1%; Temperature Coefficient: 50ppm/°C; Power Rating: 62.5mW; Voltage Rating: 50V; Max Power Dissipation: 63mW; item_number: E-RES-00002-00; Supplier 1: Digi-Key; Supplier Part Number 1: YAG1234CT-ND; Stock 1: 16655; Pricing 1: 1=0.1, 10=0.076, 100=0.029, 1000=0.0128, 2500=0.011, 5000=0.0099 (USD); Case/Package: 0402; Case Code (Metric): 1005; Case Code (Imperial): 0402; Contact Plating: Tin,Lead,Matte; Min Operating Temperature: -55°C; Max Operating Temperature: 125°C; Packaging: Tape and Reel; Resistance: 1k; Composition: Thin Film; Termination: SMD/SMT; Number of Terminations: 2; Package Quantity: 10000; Military Standard: Not; Voltage Rating (DC): 50V; Length: 1mm; Height: 0.014inch; Width: 0.02inch; Depth: 0.5mm; Radiation Hardening: No; Lead Free: Lead Free; ComponentLink1URL: https://datasheet.ciiva.com/12834/pyu-rt-1-to-0-05-rohs-l-4-12834181.pdf; ComponentLink1Description: https://datasheet.ciiva.com/12834/pyu-rt-1-to-0-05-rohs-l-4-12834181.pdf; ComponentLink2URL: https://datasheet.ciiva.com/25647/pyu-rt-1-to-0-05-rohs-l-4-25647306.pdf; ComponentLink2Description: https://datasheet.ciiva.com/25647/pyu-rt-1-to-0-05-rohs-l-4-25647306.pdf; ComponentLink3URL: https://datasheet.ciiva.com/8896/pyu-rt-1-to-0-05-rohs-l-4-8896188.pdf; ComponentLink3Description: https://datasheet.ciiva.com/8896/pyu-rt-1-to-0-05-rohs-l-4-8896188.pdf
R11 = 0402R-1k: Resistor 1k; Manufacturer: Yageo; Manufacturer Part Number: RT0402-FRE071KL; Tolerance: 1%; Power Rating: 62.5mW; Voltage Rating: 50V; Temperature Coefficient: 50ppm/°C; Max Power Dissipation: 63mW; item_number: E-RES-00002-00; Supplier 1: Digi-Key; Supplier Part Number 1: YAG1234CT-ND; Stock 1: 16655; Pricing 1: 1=0.1, 10=0.076, 100=0.029, 1000=0.0128, 2500=0.011, 5000=0.0099 (USD); Case/Package: 0402; Case Code (Metric): 1005; Case Code (Imperial): 0402; Contact Plating: Tin,Lead,Matte; Min Operating Temperature: -55°C; Max Operating Temperature: 125°C; Resistance: 1k; Packaging: Tape and Reel; Composition: Thin Film; Voltage Rating (DC): 50V; Number of Terminations: 2; Termination: SMD/SMT; Package Quantity: 10000; Military Standard: Not; Length: 1mm; Height: 0.014inch; Width: 0.02inch; Depth: 0.5mm; Lead Free: Lead Free; ComponentLink1URL: https://datasheet.ciiva.com/12834/pyu-rt-1-to-0-05-rohs-l-4-12834181.pdf; ComponentLink1Description: https://datasheet.ciiva.com/12834/pyu-rt-1-to-0-05-rohs-l-4-12834181.pdf; ComponentLink2URL: https://datasheet.ciiva.com/25647/pyu-rt-1-to-0-05-rohs-l-4-25647306.pdf; ComponentLink2Description: https://datasheet.ciiva.com/25647/pyu-rt-1-to-0-05-rohs-l-4-25647306.pdf; ComponentLink3URL: https://datasheet.ciiva.com/8896/pyu-rt-1-to-0-05-rohs-l-4-8896188.pdf; ComponentLink3Description: https://datasheet.ciiva.com/8896/pyu-rt-1-to-0-05-rohs-l-4-8896188.pdf; Radiation Hardening: No
R12 R14 = 0402R-27R: Resistor 27R; Manufacturer: Vishay; Manufacturer Part Number: CRCW040227R0FKED; Power Rating: 63mW; Tolerance: 1%; Voltage Rating: 50V; Temperature Coefficient: 100ppm/°C; item_number: E-RES-00007-00; Supplier 1: Digi-Key; Supplier Part Number 1: 541-27.0LCT-ND; Stock 1: 23435; Pricing 1: 1=0.1, 10=0.044, 100=0.0178, 1000=0.008, 2500=0.007, 5000=0.0058 (USD); Case/Package: 0402; Number of Pins: 2; Weight: 2.3E-05oz; Case Code (Metric): 1005; Case Code (Imperial): 0402; Contact Plating: Tin; Min Operating Temperature: -55°C; Max Operating Temperature: 155°C; Resistance: 27; Packaging: Tape and Reel; Composition: Thick Film; Voltage Rating (DC): 50V; Termination: SMD/SMT; Package Quantity: 10; Number of Terminations: 2; Military Standard: Not; Max Power Dissipation: 63mW; Length: 1mm; Height: 0.35mm; Width: 0.02inch; Depth: 0.5mm; Radiation Hardening: No; REACH SVHC: Unknown; Lead Free: Lead Free; ComponentLink1URL: https://datasheet.ciiva.com/3883/41394838s8306212n6892-3883398.pdf; ComponentLink1Description: https://datasheet.ciiva.com/3883/41394838s8306212n6892-3883398.pdf; ComponentLink2URL: https://datasheet.ciiva.com/2463/dcrcwe3-2463072.pdf; ComponentLink2Description: https://datasheet.ciiva.com/2463/dcrcwe3-2463072.pdf; ComponentLink3URL: https://datasheet.ciiva.com/11811/0900766b80d98824-11811652.pdf; ComponentLink3Description: https://datasheet.ciiva.com/11811/0900766b80d98824-11811652.pdf; ComponentLink4URL: https://datasheet.ciiva.com/16886/dcrcwe3-16886856.pdf; ComponentLink4Description: https://datasheet.ciiva.com/16886/dcrcwe3-16886856.pdf; ComponentLink5URL: https://datasheet.ciiva.com/7672/1697337-7672793.pdf; ComponentLink5Description: https://datasheet.ciiva.com/7672/1697337-7672793.pdf; ComponentLink6URL: https://datasheet.ciiva.com/8336/dcrcwe3-8336681.pdf; ComponentLink6Description: https://datasheet.ciiva.com/8336/dcrcwe3-8336681.pdf; ComponentLink7URL: https://datasheet.ciiva.com/7672/1697337-7672794.pdf; ComponentLink7Description: https://datasheet.ciiva.com/7672/1697337-7672794.pdf; ComponentLink8URL: https://datasheet.ciiva.com/22675/1912744-22675082.pdf; ComponentLink8Description: https://datasheet.ciiva.com/22675/1912744-22675082.pdf; ComponentLink9URL: https://datasheet.ciiva.com/16373/dcrcwe3-16373179.pdf; ComponentLink9Description: https://datasheet.ciiva.com/16373/dcrcwe3-16373179.pdf; ComponentLink10URL: https://datasheet.ciiva.com/26316/fld-crcw-e3-data-en-26316667.pdf; ComponentLink10Description: https://datasheet.ciiva.com/26316/fld-crcw-e3-data-en-26316667.pdf; ComponentLink11URL: https://datasheet.ciiva.com/22870/70201119-22870060.pdf; ComponentLink11Description: https://datasheet.ciiva.com/22870/70201119-22870060.pdf; ComponentLink12URL: https://datasheet.ciiva.com/5548/dcrcwe3-109170-5548813.pdf; ComponentLink12Description: https://datasheet.ciiva.com/5548/dcrcwe3-109170-5548813.pdf; ComponentLink13URL: https://datasheet.ciiva.com/2463/dcrcwe3-2463070.pdf; ComponentLink13Description: https://datasheet.ciiva.com/2463/dcrcwe3-2463070.pdf; ComponentLink14URL: https://datasheet.ciiva.com/22704/1697337-22704430.pdf; ComponentLink14Description: https://datasheet.ciiva.com/22704/1697337-22704430.pdf; ComponentLink15URL: https://datasheet.ciiva.com/2463/dcrcwe3-2463071.pdf; ComponentLink15Description: https://datasheet.ciiva.com/2463/dcrcwe3-2463071.pdf
R15 R16 = 0402R-0R0: Resistor 0R; Manufacturer: Yageo; Manufacturer Part Number: RC0402FR-070RL; Resistance: 0mR; Tolerance: 1%; Power Rating: 62.5mW; Voltage Rating: 50V; Temperature Coefficient: 200ppm/°C; Supplier 1: Mouser; Supplier Part Number 1: 603-RC0402FR-070RL; Stock 1: 240535; Pricing 1: 1=0.1, 10=0.01, 50=0.01, 100=0.003, 1000=0.002, 10000=0.002 (USD); Case/Package: 0402; Contact Plating: Tin,Matte; Case Code (Imperial): 0402; Case Code (Metric): 1005; Min Operating Temperature: -55°C; Max Operating Temperature: 155°C; Composition: Thick Film; Packaging: Tape and Reel; Termination: SMD/SMT; Length: 1mm; Height: 0.35mm; Width: 0.5mm; Radiation Hardening: No; Lead Free: Lead Free; ComponentLink1URL: https://datasheet.ciiva.com/8896/pyu-rc0402-51-rohs-l-6-8896149.pdf; ComponentLink1Description: https://datasheet.ciiva.com/8896/pyu-rc0402-51-rohs-l-6-8896149.pdf; ComponentLink2URL: https://datasheet.ciiva.com/16790/pyu-rc0402-51-rohs-l-6-r-16790444.pdf; ComponentLink2Description: https://datasheet.ciiva.com/16790/pyu-rc0402-51-rohs-l-6-r-16790444.pdf; ComponentLink3URL: https://datasheet.ciiva.com/28419/pyu-rc0402-51-rohs-l-6-28419661.pdf; ComponentLink3Description: https://datasheet.ciiva.com/28419/pyu-rc0402-51-rohs-l-6-28419661.pdf; ComponentLink4URL: https://datasheet.ciiva.com/16869/pyu-rc0402-51-rohs-l-6-16869518.pdf; ComponentLink4Description: https://datasheet.ciiva.com/16869/pyu-rc0402-51-rohs-l-6-16869518.pdf; Value: 0; item_number: =item_name
S1 = FSMSM: SMD Tact Switch; Manufacturer: TE Connectivity Alcoswitch; Mechanical Life: 20000Cycles; Actuator Material: Polyamide; Voltage Rating (DC): 24V; Throw Configuration: SPST; Operating Force: 180gf; Contact Resistance: 100mR; Max Voltage Rating (DC): 12V; Current Rating: 50mA; Illumination Type: Non-Illuminated,Illuminated; Switch Travel: 0.25mm; Switch Function: Off-Mom; Actuator Type: Standard; Actuator Length: 0.042inch; item_number: E-SWI-00020-00; Supplier 1: Digi-Key; Supplier Part Number 1: 450-1140-ND; Manufacturer Part Number: FSMSM; Stock 1: 15505; Pricing 1: 1=0.27, 10=0.259, 25=0.25, 50=0.241, 100=0.2276, 250=0.2142, 500=0.2053, 1000=0.1562, 5000=0.1294 (USD); Mount: Surface Mount; Contact Material: Brass; Contact Plating: Silver; Min Operating Temperature: -35°C; Max Operating Temperature: 85°C; Termination: Gull Wing; Package Quantity: 1000; Packaging: Loose Piece; Electrical Life: 20000Cycles; Orientation: Straight; Contact Current Rating: 50mA; Type: Switch; REACH SVHC: Unknown; ELV: Compliant; Lead Free: Lead Free; ComponentLink1URL: https://datasheet.ciiva.com/5801/1651495-5801350.pdf; ComponentLink1Description: https://datasheet.ciiva.com/5801/1651495-5801350.pdf; ComponentLink2URL: https://datasheet.ciiva.com/14540/70156014-14540390.pdf; ComponentLink2Description: https://datasheet.ciiva.com/14540/70156014-14540390.pdf; ComponentLink3URL: https://datasheet.ciiva.com/5283/ng-cd-1437566-3-c1-116271-5283400.pdf; ComponentLink3Description: https://datasheet.ciiva.com/5283/ng-cd-1437566-3-c1-116271-5283400.pdf; ComponentLink4URL: https://datasheet.ciiva.com/2899/fsmseries-2899676.pdf; ComponentLink4Description: https://datasheet.ciiva.com/2899/fsmseries-2899676.pdf
SB1-SB3 = SBNC: Solderbridge, Normally Closed; Part Number: Solderbridge Shorted; Artikkelnr Noca: N.A.; Manufacturer: *; Manufacturer Part Number: *; Datasheet: *; LatestRevisionDate: 2012-08-07; Pin Count: 2; Publisher: Nordic Semiconductor; Published: 2012-08-07; Value: Solderbridge; Note: *; Supplier: *; Supplier part number: *; 2nd source Supplier: *; 2nd source part number: *; Footprint Doc: Solderbridge_Shorted; Artikkelnr Simpro: N.A.
TP3-TP11 = TP1MM: 1mm Test Point; item_number: =item_name
U1 = ATECC508A: Afero Custom CryptoAuthentication Device; Manufacturer: Microchip / Atmel; Manufacturer Part Number: ATECC508A-MAHCZ-T; item_number: E-ICS-00072-00; Supplier 1: Digi-Key; Supplier Part Number 1: 1611-ATECC508A-MAHCZ-TCT-ND; Stock 1: 4638; Pricing 1: 1=0.35, 25=0.32, 100=0.29 (USD); Mount: Surface Mount; Min Operating Temperature: -40°C; Max Operating Temperature: 85°C; Packaging: Tape and Reel
U2 = S-1313A33-M5T1U3: Low Current Consumption LDO; Manufacturer: Seiko; Output Voltage: 3.3V; Dropout Voltage: 160mV; Output Voltage Accuracy: 1%; item_number: E-ICS-00092-00; Supplier 1: Digi-Key; Supplier Part Number 1: S-1313A33-M5T1U3-ND; Manufacturer Part Number: S-1313A33-M5T1U3; Stock 1: 0; Case/Package: SOT-23-5
U3 = FT230XQ: USB to UART Bridge; Manufacturer: FTDI; Manufacturer Part Number: FT230XQ-R; Data Rate: 12 Mb/s; Speed: Full Speed; Interface Type: UART, USB; Operating Supply Current: 6.5 mA to 8.3 mA; Operating Supply Voltage: 2.97 V to 5.5 V; Supply Voltage - Max: 5.5 V; Supply Voltage - Min: 2.97 V; item_number: E-ICS-00053-00; Supplier 1: Mouser; RoHS: RoHS Compliant; Category: USB Interface IC; Stock 1: 86769; Pricing 1: 1=2.04, 25=1.97, 100=1.90, 250=1.71, 500=1.54, 1000=1.46, 2500=1.38, 5000=1.38 (USD); Package / Case: QFN-16; Packaging: Cut Tape; Product: USB Bridge Controllers; Series: FT230; Type: Bridge, USB to UART; Brand: FTDI; Mounting Style: SMD/SMT; Maximum Operating Temperature: + 85 C; Minimum Operating Temperature: - 40 C; Moisture Sensitive: Yes; Standard: USB 2.0; Standard Pack Qty: 5000; Tradename: X-CHIP; RoHS - Mouser: Y; Minimum Order Quantity: 1; Reeling: True; ComponentLink1URL: http://www.mouser.com/ds/2/163/DS_FT230X-5395.pdf; ComponentLink1Description: http://www.mouser.com/ds/2/163/DS_FT230X-5395.pdf; Supplier Part Number 1: 895-FT230XQ-R
USB1 = 10103594-0001LF: MICRO USB B; Manufacturer: Amphenol FCI; Gender: Receptacle; Voltage Rating: 100V; Current Rating: 1.8A; Connector Type: USB,Receptacle; Number of Ports: 1; Insulation Resistance: 1GR; Number of Contacts: 5; USB Standard: USB 2.0; Pitch: 0.65mm; item_number: M-CON-00011-00; Supplier 1: Digi-Key; Supplier Part Number 1: 609-4050-1-ND; Manufacturer Part Number: 10103594-0001LF; Stock 1: 103885; Pricing 1: 1=0.82, 10=0.721, 25=0.6788, 50=0.6504, 100=0.6221, 250=0.5655, 500=0.509 (USD); Mount: Surface Mount,Horizontal; Contact Plating: Gold; Contact Material: Copper,Copper Alloy; Number of Terminals: 5; Housing Material: Thermoplastic; Min Operating Temperature: -55°C; Max Operating Temperature: 85°C; Termination: Solder; Orientation: Right Angle; Packaging: Tape and Reel; Package Quantity: 1500; Max Voltage Rating (AC): 100V; Features: Shielded; Length: 8.04mm; Radiation Hardening: No; REACH SVHC: No SVHC; Lead Free: Lead Free; ComponentLink1URL: https://datasheet.ciiva.com/8015/10103594-8015248.pdf; ComponentLink1Description: https://datasheet.ciiva.com/8015/10103594-8015248.pdf; ComponentLink2URL: https://datasheet.ciiva.com/11731/0900766b80ed1ae4-11731328.pdf; ComponentLink2Description: https://datasheet.ciiva.com/11731/0900766b80ed1ae4-11731328.pdf; ComponentLink3URL: https://datasheet.ciiva.com/14618/70236822-14618885.pdf; ComponentLink3Description: https://datasheet.ciiva.com/14618/70236822-14618885.pdf; ComponentLink4URL: https://datasheet.ciiva.com/22654/1469075-22654519.pdf; ComponentLink4Description: https://datasheet.ciiva.com/22654/1469075-22654519.pdf; ComponentLink5URL: https://datasheet.ciiva.com/851/10103594-851115.pdf; ComponentLink5Description: https://datasheet.ciiva.com/851/10103594-851115.pdf; ComponentLink6URL: https://datasheet.ciiva.com/5726/10103594-5726971.pdf; ComponentLink6Description: https://datasheet.ciiva.com/5726/10103594-5726971.pdf; ComponentLink7URL: https://datasheet.ciiva.com/851/10103594-851116.pdf; ComponentLink7Description: https://datasheet.ciiva.com/851/10103594-851116.pdf; ComponentLink8URL: https://datasheet.ciiva.com/851/10103594-851117.pdf; ComponentLink8Description: https://datasheet.ciiva.com/851/10103594-851117.pdf